# EAGLE design Schematic_Amplifier_2.0.0 (EAGLE 7.5.0)

## Sheet 1 of 2: Power
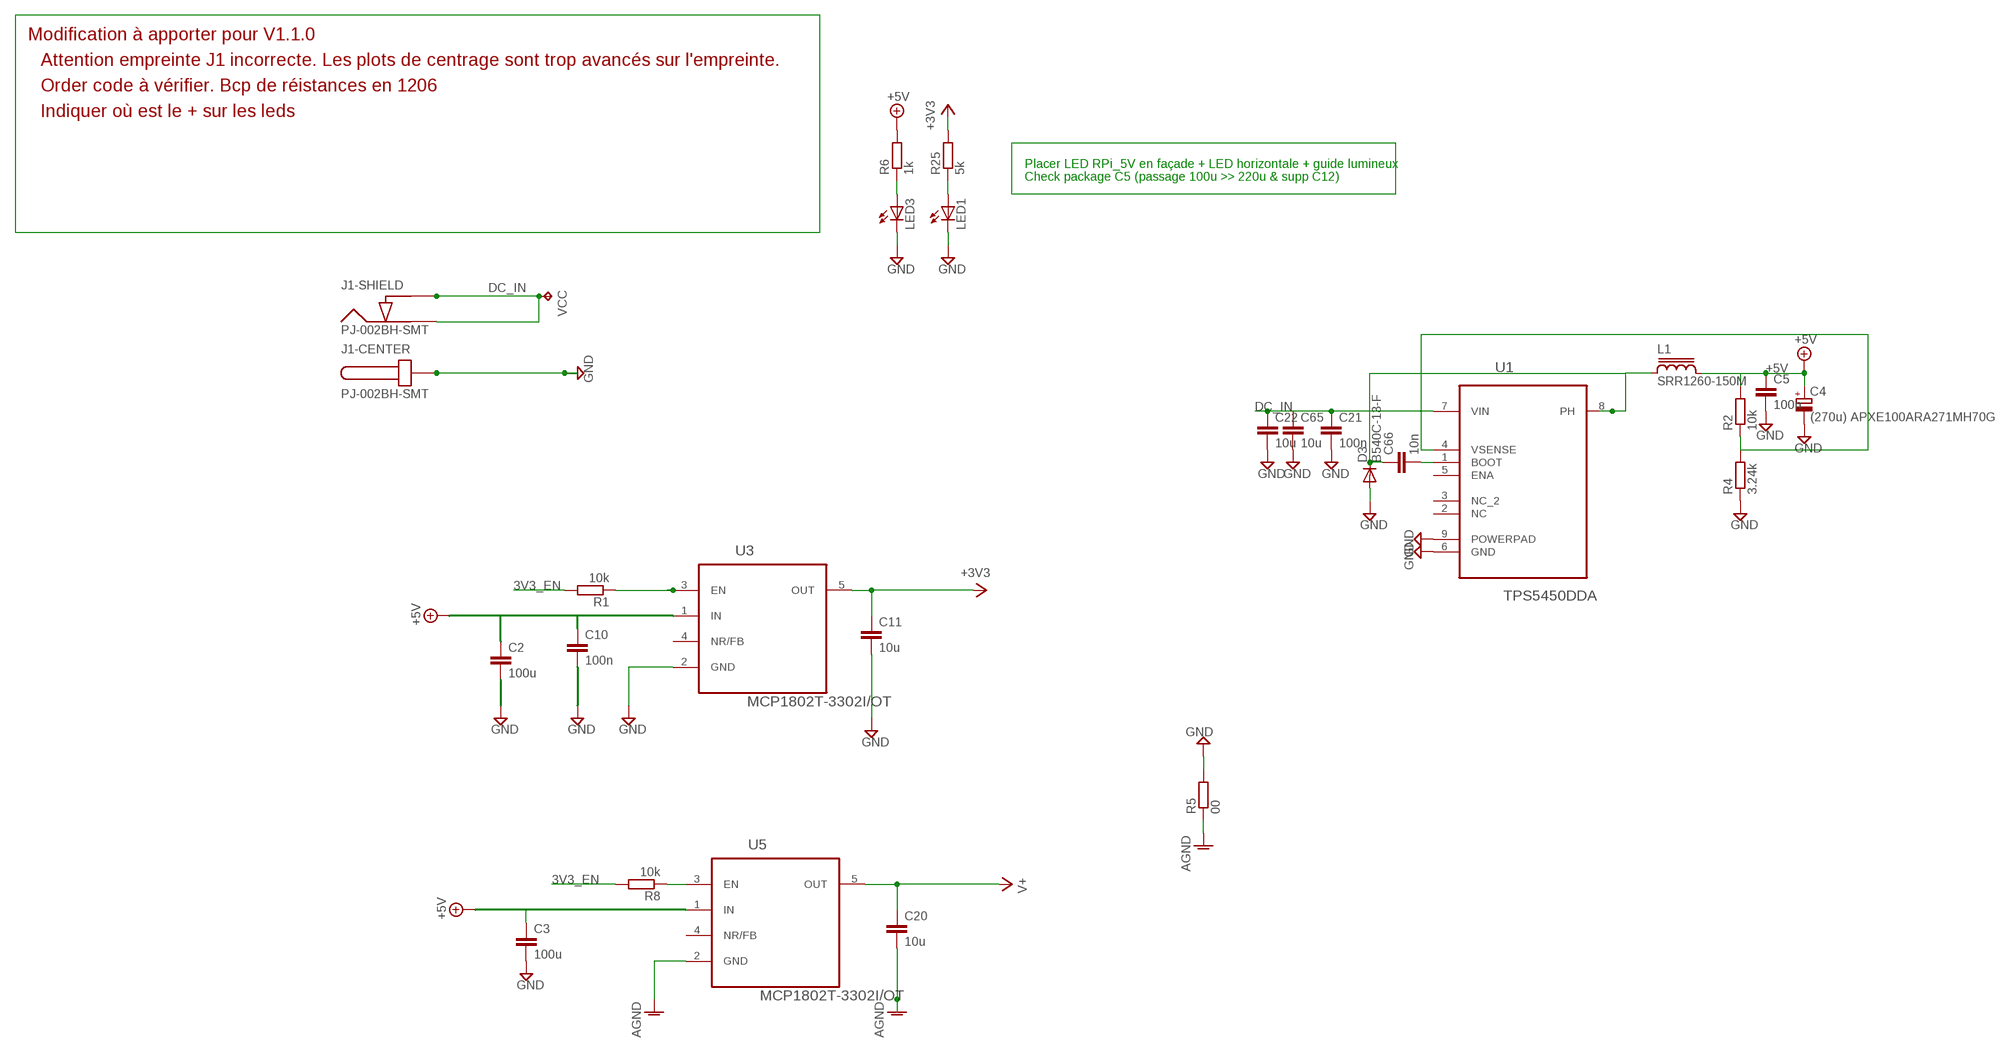
[diagram p0: schematic, sheet 1]

### Parts
C2  100u  C-EUC1206  [C1206]
C3  100u  C-EUC1206  [C1206]
C4  (270u) APXE100ARA271MH70G  CPOL-EU175TMP-0810  [175TMP-0810]
C5  100n  C-EUC0603  [C0603]
C10  100n  C-EUC0603  [C0603]
C11  10u  C-EUC0805  [C0805]
C20  10u  C-EUC0805  [C0805]
C21  100n  C-EUC0603  [C0603]
C22  10u  C-EUC0805  [C0805]
C65  10u  C-EUC0805  [C0805]
C66  10n  C-EUC0603  [C0603]
D3  B540C-13-F  DIODE-SMC  [SMC]
J1  PJ-002BH-SMT  [002BH-SMT]
L1  SRR1260-150M  SRR1280  [SRR1280]
LED1  LEDSML0603  [SML0603]
LED3  LEDSML1206  [SML1206]
R1  10k  R-EU_R0603  [R0603]
R2  10k  R-EU_R0603  [R0603]
R4  3.24k  R-EU_R0603  [R0603]
R5  00  R-EU_R0603  [R0603]
R6  1k  R-EU_R0603  [R0603]
R8  10k  R-EU_R0603  [R0603]
R25  5k  R-EU_R0603  [R0603]
U1  TPS5450DDA  [SOIC127P600X170-9N]
U3  MCP1802T-3302I/OT  TPS73633DBVT  [SOT95P280X145-5N]
U5  MCP1802T-3302I/OT  TPS73633DBVT  [SOT95P280X145-5N]
VCC  TPTP20R  [TP20R]

### Nets
3V3_EN: R1.2 R8.2 ; also sheet 2
+3V3 [+3V3]: C11.1 R25.2 U3.5(OUT) ; also sheet 2
+5V [+3V3]: C2.1 C3.1 C4.+ C5.1 C10.1 L1.2 R2.2 R6.2 U3.1(IN) U5.1(IN) ; also sheet 2
AGND: C20.2 R5.1 U5.2(GND) ; also sheet 2
DC_IN: C21.1 C22.1 C65.1 J1.2 J1.3 U1.7(VIN) VCC.TP ; also sheet 2
GND [GND]: C2.2 C3.2 C4.- C5.2 C10.2 C11.2 C21.2 C22.2 C65.2 D3.A J1.CENTER1 J1.CENTER2 LED1.C LED3.C R4.1 R5.2 U1.6(GND) U1.9(POWERPAD) U3.2(GND) ; also sheet 2
N$6: R1.1 U3.3(EN)
N$9: LED1.A R25.1
N$12: C66.2 U1.1(BOOT)
N$14: LED3.A R6.1
N$54: R8.1 U5.3(EN)
N$56: C66.1 D3.C L1.1 U1.8(PH)
N$57: R2.1 R4.2 U1.4(VSENSE)
V+ [+3V3]: C20.1 U5.5(OUT) ; also sheet 2
Unconnected: U1.2(NC) U1.3(NC_2) U1.5(ENA) U3.4(NR/FB) U5.4(NR/FB)

### Notes on the sheet
- Modification à apporter pour V1.1.0
- Attention empreinte J1 incorrecte. Les plots de centrage sont trop avancés sur l'empreinte.
- Order code à vérifier. Bcp de réistances en 1206
- Indiquer où est le + sur les leds
- Placer LED RPi_5V en façade + LED horizontale + guide lumineux
- Check package C5 (passage 100u >> 220u & supp C12)

## Sheet 2 of 2: Core
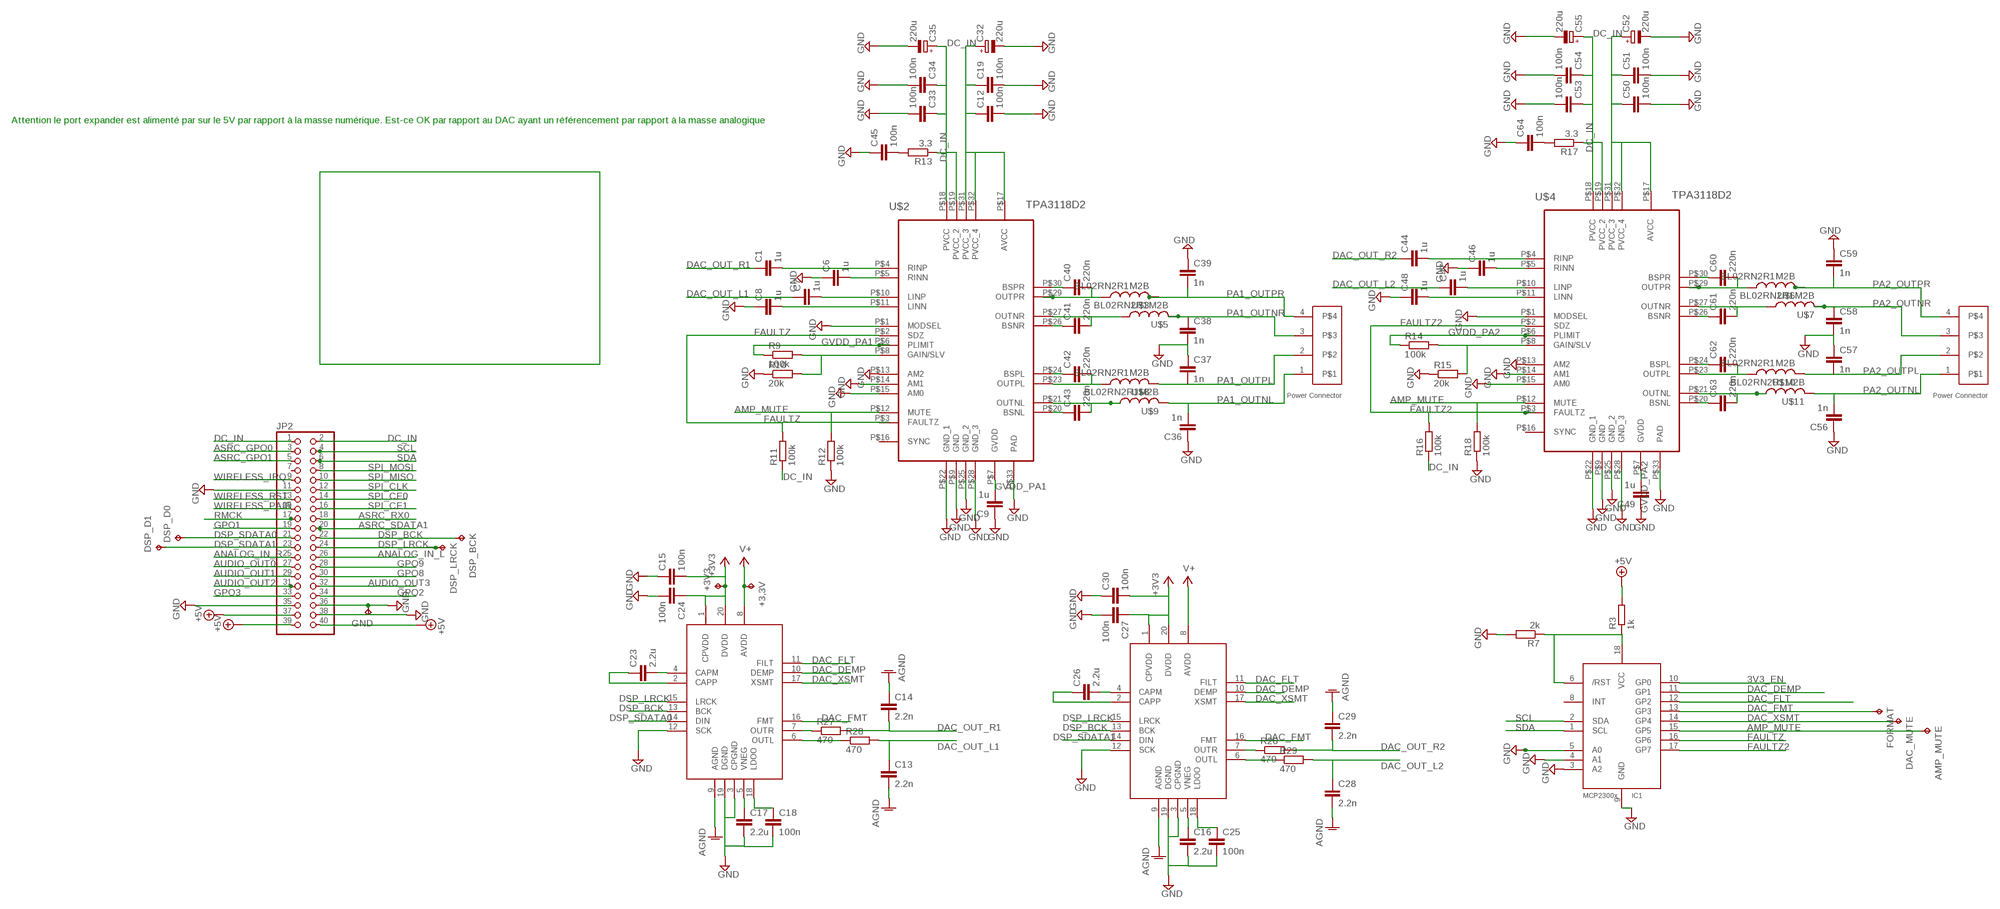
[diagram p1: schematic, sheet 2]

### Parts
+3,3V  TPTP10R  [TP10R]
+3V3  TPTP10R  [TP10R]
AMP_MUTE  TPTP08R  [TP08R]
C1  1u  C-EUC0603  [C0603]
C6  1u  C-EUC0603  [C0603]
C7  1u  C-EUC0603  [C0603]
C8  1u  C-EUC0603  [C0603]
C9  1u  C-EUC0603  [C0603]
C12  100n  C-EUC0603  [C0603]
C13  2.2n  C-EUC0603  [C0603]
C14  2.2n  C-EUC0603  [C0603]
C15  100n  C-EUC0603  [C0603]
C16  2.2u  C-EUC0603  [C0603]
C17  2.2u  C-EUC0603  [C0603]
C18  100n  C-EUC0603  [C0603]
C19  100n  C-EUC0603  [C0603]
C23  2.2u  C-EUC0603  [C0603]
C24  100n  C-EUC0603  [C0603]
C25  100n  C-EUC0603  [C0603]
C26  2.2u  C-EUC0603  [C0603]
C27  100n  C-EUC0603  [C0603]
C28  2.2n  C-EUC0603  [C0603]
C29  2.2n  C-EUC0603  [C0603]
C30  100n  C-EUC0603  [C0603]
C32  220u  CPOL-EUE2.5-6  [E2,5-6]
C33  100n  C-EUC0603  [C0603]
C34  100n  C-EUC0603  [C0603]
C35  220u  CPOL-EUE2.5-6  [E2,5-6]
C36  1n  C-EUC0603  [C0603]
C37  1n  C-EUC0603  [C0603]
C38  1n  C-EUC0603  [C0603]
C39  1n  C-EUC0603  [C0603]
C40  220n  C-EUC0603  [C0603]
C41  220n  C-EUC0603  [C0603]
C42  220n  C-EUC0603  [C0603]
C43  220n  C-EUC0603  [C0603]
C44  1u  C-EUC0603  [C0603]
C45  100n  C-EUC0603  [C0603]
C46  1u  C-EUC0603  [C0603]
C47  1u  C-EUC0603  [C0603]
C48  1u  C-EUC0603  [C0603]
C49  1u  C-EUC0603  [C0603]
C50  100n  C-EUC0603  [C0603]
C51  100n  C-EUC0603  [C0603]
C52  220u  CPOL-EUE2.5-6  [E2,5-6]
C53  100n  C-EUC0603  [C0603]
C54  100n  C-EUC0603  [C0603]
C55  220u  CPOL-EUE2.5-6  [E2,5-6]
C56  1n  C-EUC0603  [C0603]
C57  1n  C-EUC0603  [C0603]
C58  1n  C-EUC0603  [C0603]
C59  1n  C-EUC0603  [C0603]
C60  220n  C-EUC0603  [C0603]
C61  220n  C-EUC0603  [C0603]
C62  220n  C-EUC0603  [C0603]
C63  220n  C-EUC0603  [C0603]
C64  100n  C-EUC0603  [C0603]
DAC0  PCM5102A  [20L-TSSOP]
DAC1  PCM5102A  [20L-TSSOP]
DAC_MUTE  TPTP08R  [TP08R]
DSP_BCK  TPTP08R  [TP08R]
DSP_D0  TPTP08R  [TP08R]
DSP_D1  TPTP08R  [TP08R]
DSP_LRCK  TPTP08R  [TP08R]
FORMAT  TPTP08R  [TP08R]
GND  TPTP19SQ  [TP19SQ]
IC1  MCP23008/SO  [SO18W]
JP2  PINHD-2X20  [2X20]
R3  1k  R-EU_R0603  [R0603]
R7  2k  R-EU_R0603  [R0603]
R9  100k  R-EU_R0603  [R0603]
R10  20k  R-EU_R0603  [R0603]
R11  100k  R-EU_R0603  [R0603]
R12  100k  R-EU_R0603  [R0603]
R13  3.3  R-EU_R0603  [R0603]
R14  100k  R-EU_R0603  [R0603]
R15  20k  R-EU_R0603  [R0603]
R16  100k  R-EU_R0603  [R0603]
R17  3.3  R-EU_R0603  [R0603]
R18  100k  R-EU_R0603  [R0603]
R26  470  R-EU_R0603  [R0603]
R27  470  R-EU_R0603  [R0603]
R28  470  R-EU_R0603  [R0603]
R29  470  R-EU_R0603  [R0603]
U$1  1-1123723-4  [POWER_CON_HEADER]
U$2  TPA3118D2  [TSSOP32]
U$3  BL02RN2R1M2B  FB  [FB]
U$4  TPA3118D2  [TSSOP32]
U$5  BL02RN2R1M2B  FB  [FB]
U$6  BL02RN2R1M2B  FB  [FB]
U$7  BL02RN2R1M2B  FB  [FB]
U$8  BL02RN2R1M2B  FB  [FB]
U$9  BL02RN2R1M2B  FB  [FB]
U$10  BL02RN2R1M2B  FB  [FB]
U$11  BL02RN2R1M2B  FB  [FB]
U$12  1-1123723-4  [POWER_CON_HEADER]

### Nets
3V3_EN: IC1.10(GP0) ; also sheet 1
$OUTR: DAC0.7(OUTR) R26.1
+3V3 [+3V3]: +3V3.TP C15.2 C24.1 C27.1 C30.2 DAC0.1(CPVDD) DAC0.20(DVDD) DAC1.1(CPVDD) DAC1.20(DVDD) ; also sheet 1
+5V [+3V3]: JP2.37 JP2.39 JP2.40 R3.2 ; also sheet 1
AGND: C13.2 C14.1 C28.2 C29.1 DAC0.9(AGND) DAC1.9(AGND) ; also sheet 1
AMP_MUTE: AMP_MUTE.TP IC1.15(GP5) R12.2 R18.2 U$2.P$12(MUTE) U$4.P$12(MUTE)
ANALOG_IN_L: JP2.26
ANALOG_IN_R: JP2.25
ASRC_GPO0: JP2.3
ASRC_GPO1: JP2.5
ASRC_RX0 [Clock]: JP2.18
ASRC_SDATA1 [Clock]: JP2.20
AUDIO_OUT0: JP2.27
AUDIO_OUT1: JP2.29
AUDIO_OUT2: JP2.31
AUDIO_OUT3: JP2.32
DAC_DEMP: DAC0.10(DEMP) DAC1.10(DEMP) IC1.11(GP1)
DAC_FLT: DAC0.11(FILT) DAC1.11(FILT) IC1.12(GP2)
DAC_FMT: DAC0.16(FMT) DAC1.16(FMT) FORMAT.TP IC1.13(GP3)
DAC_OUT_L1: C7.1 C13.1 R28.2
DAC_OUT_L2: C28.1 C47.1 R29.2
DAC_OUT_R1: C1.1 C14.2 R27.2
DAC_OUT_R2: C29.2 C44.1 R26.2
DAC_XSMT: DAC0.17(XSMT) DAC1.17(XSMT) DAC_MUTE.TP IC1.14(GP4)
DC_IN: C12.1 C19.1 C32.+ C33.1 C34.1 C35.+ C50.1 C51.1 C52.+ C53.1 C54.1 C55.+ JP2.1 JP2.2 R11.1 R13.1 R16.1 R17.1 U$2.P$17(AVCC) U$2.P$18(PVCC) U$2.P$31(PVCC_3) U$2.P$32(PVCC_4) U$4.P$17(AVCC) U$4.P$18(PVCC) U$4.P$31(PVCC_3) U$4.P$32(PVCC_4) ; also sheet 1
DSP_BCK [Clock]: DAC0.13(BCK) DAC1.13(BCK) DSP_BCK.TP JP2.22
DSP_LRCK [Clock]: DAC0.15(LRCK) DAC1.15(LRCK) DSP_LRCK.TP JP2.24
DSP_SDATA0 [Clock]: DAC1.14(DIN) DSP_D0.TP JP2.21
DSP_SDATA1 [Clock]: DAC0.14(DIN) DSP_D1.TP JP2.23
FAULTZ: IC1.16(GP6) R11.2 U$2.P$2(SDZ)
FAULTZ2: IC1.17(GP7) R16.2 U$4.P$2(SDZ) U$4.P$3(FAULTZ)
GND [GND]: C6.1 C8.1 C9.1 C12.2 C15.1 C16.2 C17.2 C18.2 C19.2 C24.2 C25.2 C27.2 C30.1 C32.- C33.2 C34.2 C35.- C36.1 C37.1 C38.2 C39.1 C45.1 C46.1 C48.1 C49.1 C50.2 C51.2 C52.- C53.2 C54.2 C55.- C56.1 C57.1 C58.2 C59.1 C64.1 DAC0.3(CPGND) DAC0.12(SCK) DAC0.19(DGND) DAC1.3(CPGND) DAC1.12(SCK) DAC1.19(DGND) GND.TP IC1.3(A2) IC1.4(A1) IC1.5(A0) IC1.9(GND) JP2.11 JP2.35 JP2.36 JP2.38 R7.2 R10.1 R12.1 R15.1 R18.1 U$2.P$1(MODSEL) U$2.P$9(GND) U$2.P$13(AM2) U$2.P$14(AM1) U$2.P$15(AM0) U$2.P$22(GND_1) U$2.P$25(GND_2) U$2.P$28(GND_3) U$2.P$33(PAD) U$4.P$1(MODSEL) U$4.P$9(GND) U$4.P$13(AM2) U$4.P$14(AM1) U$4.P$15(AM0) U$4.P$22(GND_1) U$4.P$25(GND_2) U$4.P$28(GND_3) U$4.P$33(PAD) ; also sheet 1
GPO1: JP2.19
GPO2: JP2.34
GPO3: JP2.33
GPO8: JP2.30
GPO9: JP2.28
GVDD_PA1: C9.2 R9.1 U$2.P$6(PLIMIT) U$2.P$7(GVDD)
GVDD_PA2: C49.2 R14.1 U$4.P$6(PLIMIT) U$4.P$7(GVDD)
N$3: C1.2 U$2.P$4(RINP)
N$4: IC1.6(/RST) IC1.18(VCC) R3.1 R7.1
N$5: C6.2 U$2.P$5(RINN)
N$7: C7.2 U$2.P$10(LINP)
N$8: C8.2 U$2.P$11(LINN)
N$13: U$2.P$19(PVCC_2)
N$16: R9.2 R10.2 U$2.P$8(GAIN/SLV)
N$17: C41.2 U$2.P$27(OUTNR) U$5.P$1
N$18: C40.2 U$2.P$29(OUTPR) U$3.P$1
N$19: C42.2 U$2.P$23(OUTPL) U$8.P$1
N$20: C43.2 U$2.P$21(OUTNL) U$9.P$1
N$21: C44.2 U$4.P$4(RINP)
N$22: C40.1 U$2.P$30(BSPR)
N$23: C17.1 DAC1.5(VNEG)
N$24: C23.2 DAC1.4(CAPM)
N$26: C45.2 R13.2
N$27: C46.2 U$4.P$5(RINN)
N$28: C47.2 U$4.P$10(LINP)
N$29: C41.1 U$2.P$26(BSNR)
N$30: C42.1 U$2.P$24(BSPL)
N$31: C43.1 U$2.P$20(BSNL)
N$32: C48.2 U$4.P$11(LINN)
N$33: DAC1.7(OUTR) R27.1
N$34: DAC1.6(OUTL) R28.1
N$35: C16.1 DAC0.5(VNEG)
N$36: C25.1 DAC0.18(LDOO)
N$37: C26.2 DAC0.4(CAPM)
N$38: C18.1 DAC1.18(LDOO)
N$39: C26.1 DAC0.2(CAPP)
N$40: R14.2 R15.2 U$4.P$8(GAIN/SLV)
N$41: C23.1 DAC1.2(CAPP)
N$42: DAC0.6(OUTL) R29.1
N$44: U$4.P$19(PVCC_2)
N$45: C61.2 U$4.P$27(OUTNR) U$7.P$1
N$46: C60.2 U$4.P$29(OUTPR) U$6.P$1
N$47: C62.2 U$4.P$23(OUTPL) U$10.P$1
N$48: C63.2 U$4.P$21(OUTNL) U$11.P$1
N$49: C60.1 U$4.P$30(BSPR)
N$50: C61.1 U$4.P$26(BSNR)
N$51: C62.1 U$4.P$24(BSPL)
N$52: C63.1 U$4.P$20(BSNL)
N$53: C64.2 R17.2
PA1_OUTNL: C36.2 U$1.1 U$9.P$2
PA1_OUTNR: C38.1 U$1.3 U$5.P$2
PA1_OUTPL: C37.2 U$1.2 U$8.P$2
PA1_OUTPR: C39.2 U$1.4 U$3.P$2
PA2_OUTNL: C56.2 U$11.P$2 U$12.1
PA2_OUTNR: C58.1 U$7.P$2 U$12.3
PA2_OUTPL: C57.2 U$10.P$2 U$12.2
PA2_OUTPR: C59.2 U$6.P$2 U$12.4
RMCK [Clock]: JP2.17
SCL: IC1.2(SDA) JP2.4
SDA: IC1.1(SCL) JP2.6
SPI_CE0 [GND]: JP2.14
SPI_CE1 [GND]: JP2.16
SPI_CLK: JP2.12
SPI_MISO: JP2.10
SPI_MOSI: JP2.8
V+ [+3V3]: +3,3V.TP DAC0.8(AVDD) DAC1.8(AVDD) ; also sheet 1
WIRELESS_IRQ: JP2.9
WIRELESS_PAIR: JP2.15
WIRELESS_RST: JP2.13
Unconnected: IC1.8(INT) JP2.7 U$2.P$16(SYNC) U$4.P$16(SYNC)

### Notes on the sheet
- Attention le port expander est alimenté par sur le 5V par rapport à la masse numérique. Est-ce OK par rapport au DAC ayant un référencement par rapport à la masse analogique

## Power pins joined to a net without a drawn wire
FAULTZ: U$2.P$3(FAULTZ)

## Library data of the parts
+3,3V +3V3 AMP_MUTE DAC_MUTE DSP_BCK DSP_D0 DSP_D1 DSP_LRCK FORMAT GND VCC = testpad:TP: Test pad
C1-C3 C5-C30 C33 C34 C36-C51 C53 C54 C56-C66 = rcl:C-EU: CAPACITOR, European symbol
C4 = resistor:CPOL-EU: POLARIZED CAPACITOR, European symbol
C32 C35 C52 C55 = rcl:CPOL-EU: POLARIZED CAPACITOR, European symbol
D3 = diode:DIODE-: DIODE
DAC0 DAC1 = Texas Instruments_By_element14_Batch_1:PCM5102A: 2VRMS DirectPath™, 112/106/100dB Audio Stereo DAC with 32-bit, 384kHz PCM Interface
IC1 = adafruit:MCP23008: MCP23008 Inexpensive i2c i/o expander - 8 general purpose i/o pins with optional pullups
J1 = volks73-cui :PJ-?: DC Power Jack Documentation Datasheet <http://www.cui.com/product/resource/pj-002bh-smt.pdf> Datasheet <http://www.cui.com/product/resource/pj-014dh-smt.pdf> Features designed for pick and place 5A current rating narrow footprint; CATEGORY: Connectors, Interconnects; COLOR: Black; CONNECTOR_TYPE: Jack; CONTACT_MATERIAL: Copper Alloy; CONTACT_MATERIAL-PLATING: Nickel; CURRENT_RATING: 5A; DESCRIPTION: CONN POWER JACK 2.5X5.5MM HI CUR; DOCUMENTATION_LINK: <a href="http://www.cui.com/product/resource/pj-002bh-smt.pdf">Datasheet</a>; DOCUMENTATION_URL: http://www.cui.com/product/resource/pj-002bh-smt.pdf; FAMILY: Barrel - Power Connectors; FEATURES: -; GENDER: Male; HOUSING_MATERIAL: Thermoplastic; INTERNAL_SWITCHS: Single Switch, Normally Closed; MANUFACTURER: CUI Inc; MOUNTING_TYPE: Surface Mount, Right Angle; NUMBER_OF_POSITIONS-CONTACTS: 2 Conductors, 3 Contacts; OPERATING_TEMPERATURE: -25°C ~ 85°C; PART_NUMBER: PJ-002BH-SMT-TR; PLUG-MATING_PLUG_DIAMETER: 2.5mm ID, 5.5mm OD; SERIES: -; SHIELDING: Unshielded; SUPPLIER_ITEM_LINK: <a href="http://www.digikey.com/product-detail/en/PJ-002BH-SMT-TR/CP-002BHPJCT-ND/669694">Details</a>; SUPPLIER_ITEM_NUMBER: CP-002BHPJCT-ND; SUPPLIER_ITEM_URL: http://www.digikey.com/product-detail/en/PJ-002BH-SMT-TR/CP-002BHPJCT-ND/669694; SUPPLIER_LINK: <a href="http://www.digikey.com">Home Page</a>; SUPPLIER_NAME: Digi-Key; SUPPLIER_URL: http://www.digikey.com; TERMINATION: Solder; VOLTAGE-RATED: 24VDC
JP2 = pinhead:PINHD-2X20: PIN HEADER
L1 = Bourns - inductor:SRR1280: POWER INDUCTOR
LED1 LED3 = led:LED: LED OSRAM: - CHIPLED LG R971, LG N971, LY N971, LG Q971, LY Q971, LO R971, LY R971 LH N974, LH R974 LS Q976, LO Q976, LY Q976 LO Q996 - Hyper CHIPLED LW Q18S LB Q993, LB Q99A, LB R99A - SideLED LS A670, LO A670, LY A670, LG A670, LP A670 LB A673, LV A673, LT A673, LW A673 LH A674 LY A675 LS A676, LA A676, LO A676, LY A676, LW A676 LS A679, LY A679, LG A679 - Hyper Micro SIDELED® LS Y876, LA Y876, LO Y876, LY Y876 LT Y87S - SmartLED LW L88C, LW L88S LB L89C, LB L89S, LG L890 LS L89K, LO L89K, LY L89K LS L896, LA L896, LO L896, LY L896 - TOPLED LS T670, LO T670, LY T670, LG T670, LP T670 LSG T670, LSP T670, LSY T670, LOP T670, LYG T670 LG T671, LOG T671, LSG T671 LB T673, LV T673, LT T673, LW T673 LH T674 LS T676, LA T676, LO T676, LY T676, LB T676, LH T676, LSB T676, LW T676 LB T67C, LV T67C, LT T67C, LS T67K, LO T67K, LY T67K, LW E67C LS E67B, LA E67B, LO E67B, LY E67B, LB E67C, LV E67C, LT E67C LW T67C LS T679, LY T679, LG T679 LS T770, LO T770, LY T770, LG T770, LP T770 LB T773, LV T773, LT T773, LW T773 LH T774 LS E675, LA E675, LY E675, LS T675 LS T776, LA T776, LO T776, LY T776, LB T776 LHGB T686 LT T68C, LB T68C - Hyper Mini TOPLED® LB M676 - Mini TOPLED Santana® LG M470 LS M47K, LO M47K, LY M47K Source: http://www.osram.convergy.de LUXEON: - LUMILED® LXK2-PW12-R00, LXK2-PW12-S00, LXK2-PW14-U00, LXK2-PW14-V00 LXK2-PM12-R00, LXK2-PM12-S00, LXK2-PM14-U00 LXK2-PE12-Q00, LXK2-PE12-R00, LXK2-PE12-S00, LXK2-PE14-T00, LXK2-PE14-U00 LXK2-PB12-K00, LXK2-PB12-L00, LXK2-PB12-M00, LXK2-PB14-N00, LXK2-PB14-P00, LXK2-PB14-Q00 LXK2-PR12-L00, LXK2-PR12-M00, LXK2-PR14-Q00, LXK2-PR14-R00 LXK2-PD12-Q00, LXK2-PD12-R00, LXK2-PD12-S00 LXK2-PH12-R00, LXK2-PH12-S00 LXK2-PL12-P00, LXK2-PL12-Q00, LXK2-PL12-R00 Source: www.luxeon.com KINGBRIGHT: KA-3528ASYC Source: www.kingbright.com
R1-R18 R25-R29 = rcl:R-EU_: RESISTOR, European symbol
U1 = Texas Instruments_By_element14_Batch_1:TPS5450DDA: 5-A, WIDE INPUT RANGE, STEP-DOWN SWIFT CONVERTER; MPN: TPS5450DDA; OC_FARNELL: 1564960; OC_NEWARK: 37M0059; PACKAGE: SOIC-8; SUPPLIER: TEXAS INSTRUMENTS
U3 U5 = Texas Instruments_By_element14_Batch_1:TPS73633DBVT: Cap-Free, NMOS, 400mA Low-Dropout Regulator with Reverse Current Protection; MPN: TPS73633DBVT; OC_FARNELL: 1535775; OC_NEWARK: 87H2981; PACKAGE: SOT-23-5; SUPPLIER: Texas Instruments
U$1 U$12 = con-te-connectivity:1-1123723-4: Connecteurs d'alimentation usage intensif VERTICAL HDR 4P low-profile; MOUSER#: 571-111237234
U$2 U$4 = Texas Instruments_By_element14_Batch_1:TPA3118D2: Class-d stereo amplifier 2 × 30 W Into a 8-Ω BTL Load at 24 V
U$3 U$5-U$11 = adafruit:FB: Ferrite bead Digikey #P9821BK-ND

## Net classes
0 default: width 0.152 mm, clearance 0.152 mm
1 Clock: width 0.152 mm, clearance 0.152 mm
2 +3V3: width 0.152 mm, clearance 0.152 mm
3 GND: width 0.152 mm, clearance 0.152 mm

## Board
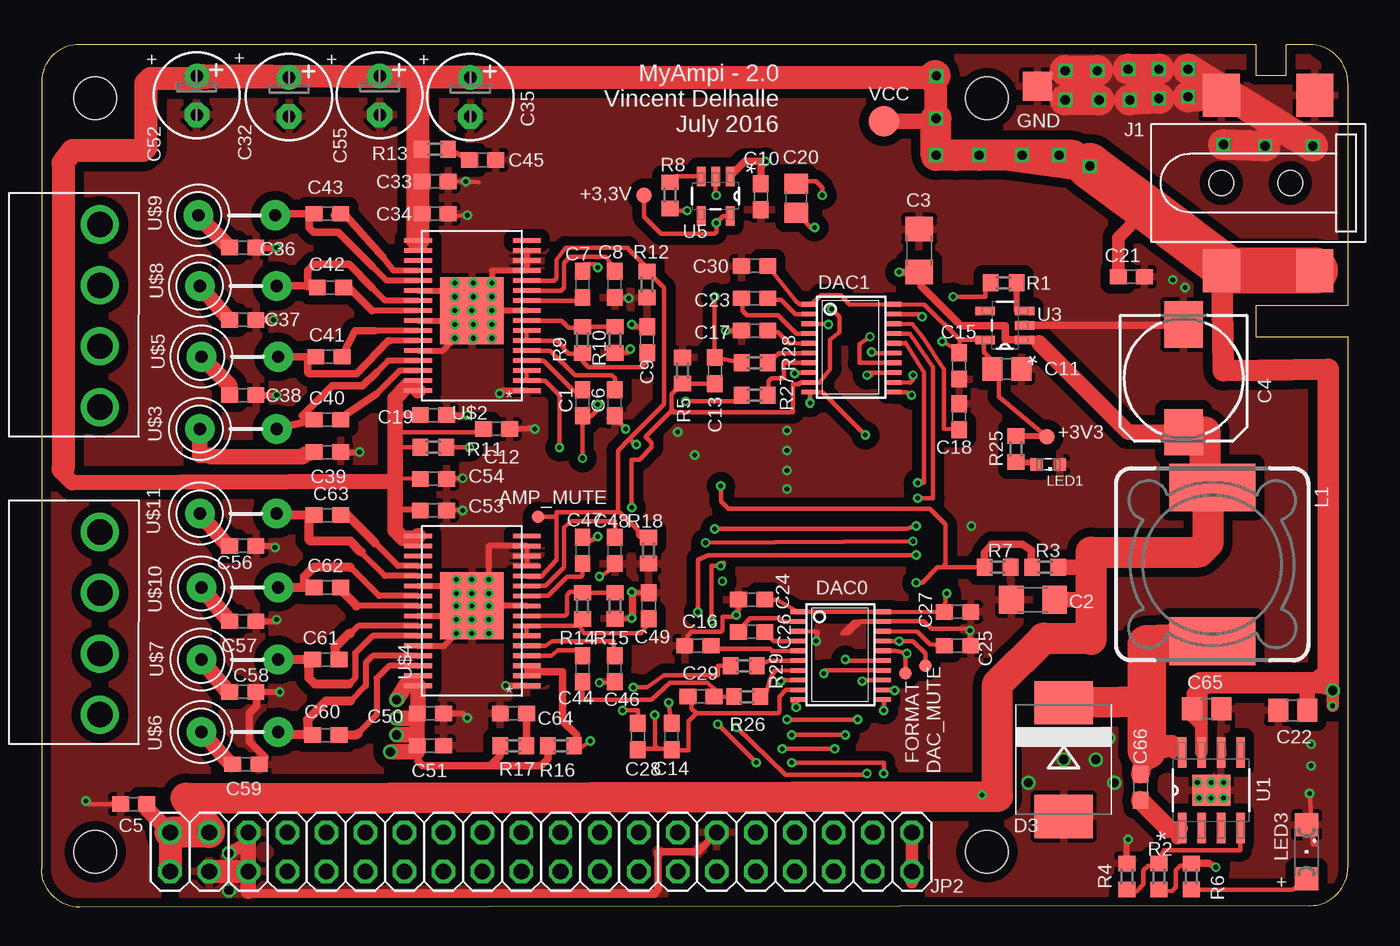
[diagram p2: board, top side]
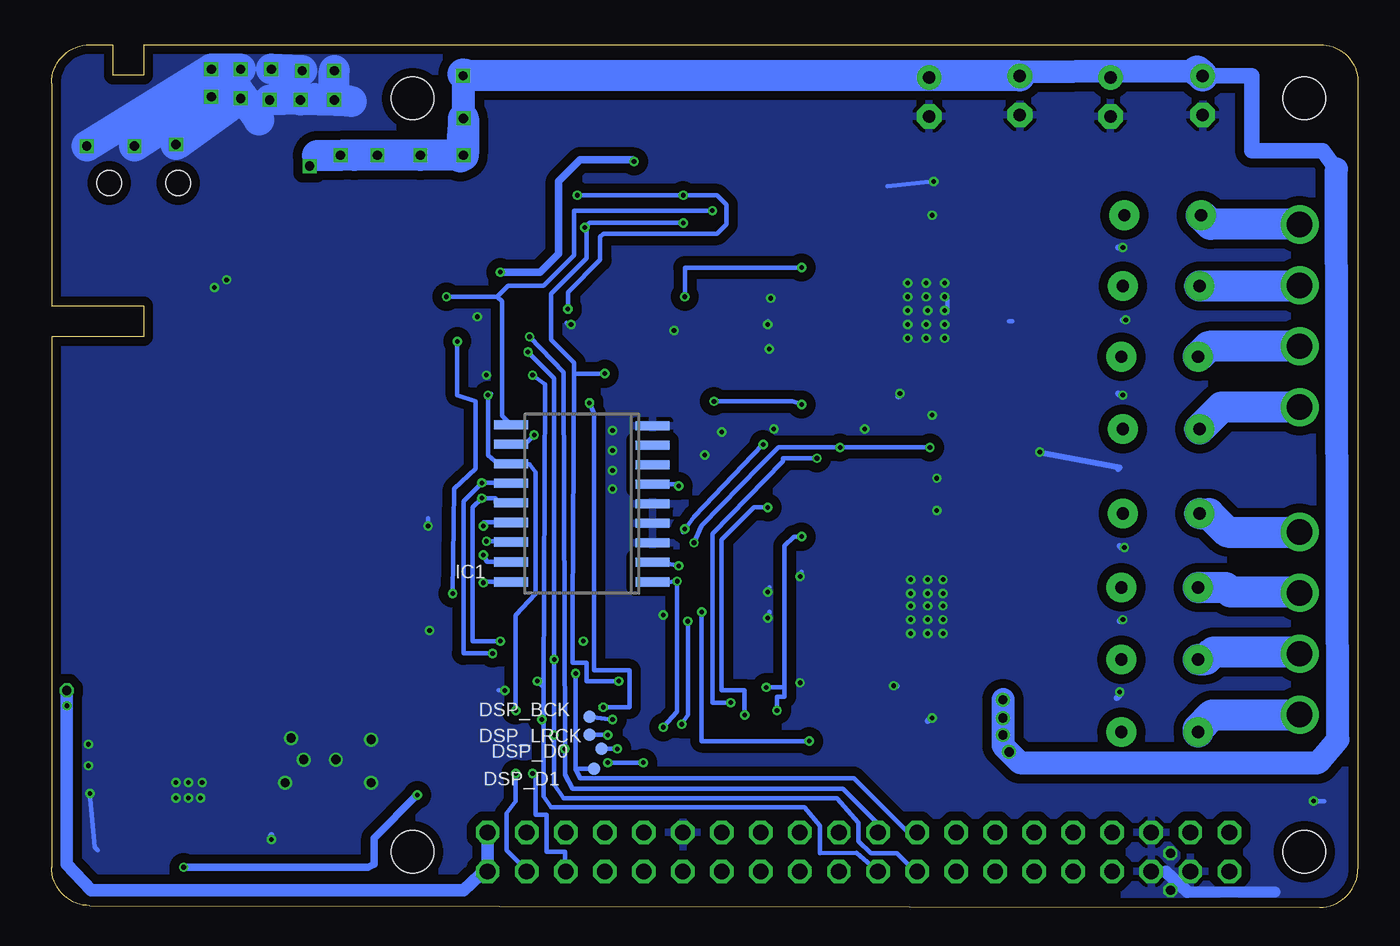
[diagram p3: board, bottom side, seen from below]

Size 85 x 56.1 mm. Coordinates in mm from the lower left corner, seen from the top.
Outline: 0,53.7 0,2.5 arc90 2.5,0 82.5,0.1 arc90 85,2.6 85,37.1 79,37.1 79,39.1 85,39.1 85,53.6 arc90 82.5,56.1 81,56.1 81,54.1 79,54.1 79,56.1 2.5,56.1 arc90 0,53.7
Copper layers (1*16): Top 0.035mm / dielectric 1.6mm / Bottom 0.035mm
Design rules "Elecrow_2-layer_PCB_eagle_rule": minimum track width 6mil, minimum drill 12mil, track to track 6mil, track to pad 8mil, pad to pad 12mil, via to via 12mil, smd to smd 0mil, copper to edge 20mil, drill to drill 10mil, minimum pad ring 6mil, minimum via ring 6mil, stop-mask expansion 0mil, vias tented up to drill 100mil, thermal gap 10mil
Holes 2.75 mm at 3.5,3.6 3.5,52.6 61.5,52.6 61.5,3.6

### Footprints (pad centres in the part's own frame; a part is rotated, then mirrored left to right if it is on the bottom)
TP10R = smd 1 x 1: TP 0,0
TP08R = smd 0.8 x 0.8: TP 0,0
C0603 = smd 1.1 x 1: 1 -0.85,0; 2 0.85,0
C1206 = smd 1.6 x 1.8: 1 -1.4,0; 2 1.4,0
175TMP-0810 = smd 3 x 2.5: + 3.5,0; - -3.5,0
C0805 = smd 1.3 x 1.5: 1 -0.95,0; 2 0.95,0
E2,5-6 = drill 0.813 pad 1.6: + -1.27,0 | drill 0.813 pad 1.6 octagon: - 1.27,0
SMC = smd 2.8 x 3.8: A 3.7,0; C -3.7,0
20L-TSSOP = smd 0.305 x 0.991: 1 -3.112,-2.378; 2 -2.478,-2.378; 3 -1.843,-2.378; 4 -1.208,-2.378; 5 -0.573,-2.378; 6 0.062,-2.378; 7 0.698,-2.378; 8 1.333,-2.378; 9 1.968,-2.378; 10 2.603,-2.378; 11 2.603,3.158; 12 1.968,3.158; 13 1.333,3.158; 14 0.698,3.158; 15 0.062,3.158; 16 -0.573,3.158; 17 -1.208,3.158; 18 -1.843,3.158; 19 -2.478,3.158; 20 -3.112,3.158
TP19SQ = smd 1.9 x 1.9: TP 0,0
SO18W = smd 0.6 x 2.2: 1 -4.445,-4.6; 2 -3.175,-4.6; 3 -1.905,-4.6; 4 -0.635,-4.6; 5 0.635,-4.6; 6 1.905,-4.6; 7 3.175,-4.6; 8 4.445,-4.6; 9 5.715,-4.6; 10 5.775,4.6; 11 4.505,4.6; 12 3.235,4.6; 13 1.965,4.6; 14 0.695,4.6; 15 -0.575,4.6; 16 -1.845,4.6; 17 -3.145,4.6; 18 -4.445,4.6
002BH-SMT = smd 2.4 x 2.8: 2 -3.05,-5.7; 3 3.05,-5.7; CENTER1 -3.05,5.7; CENTER2 3.05,5.7 | hole 1.6: -3.05,0; 1.45,0
2X20 = drill 1.016 octagon: 1 -24.13,-1.27; 2 -24.13,1.27; 3 -21.59,-1.27; 4 -21.59,1.27; 5 -19.05,-1.27; 6 -19.05,1.27; 7 -16.51,-1.27; 8 -16.51,1.27; 9 -13.97,-1.27; 10 -13.97,1.27; 11 -11.43,-1.27; 12 -11.43,1.27; 13 -8.89,-1.27; 14 -8.89,1.27; 15 -6.35,-1.27; 16 -6.35,1.27; 17 -3.81,-1.27; 18 -3.81,1.27; 19 -1.27,-1.27; 20 -1.27,1.27; 21 1.27,-1.27; 22 1.27,1.27; 23 3.81,-1.27; 24 3.81,1.27; 25 6.35,-1.27; 26 6.35,1.27; 27 8.89,-1.27; 28 8.89,1.27; 29 11.43,-1.27; 30 11.43,1.27; 31 13.97,-1.27; 32 13.97,1.27; 33 16.51,-1.27; 34 16.51,1.27; 35 19.05,-1.27; 36 19.05,1.27; 37 21.59,-1.27; 38 21.59,1.27; 39 24.13,-1.27; 40 24.13,1.27
SRR1280 = smd 5.6 x 3.1: 1 0.635,5; 2 0.635,-5
SML0603 = smd 0.8 x 0.8: A 0.75,0; C -0.75,0
SML1206 = smd 1.5 x 1.5: A 1.75,0; C -1.75,0
R0603 = smd 1 x 1.1: 1 -0.85,0; 2 0.85,0
SOIC127P600X170-9N = smd 1.981 x 0.559: 1 -2.464,1.905; 2 -2.464,0.635; 3 -2.464,-0.635; 4 -2.464,-1.905; 5 2.464,-1.905; 6 2.464,-0.635; 7 2.464,0.635; 8 2.464,1.905 | smd 2.007 x 2.489: 9 0,0
SOT95P280X145-5N = smd 1.27 x 0.559: 1 -1.295,0.94; 2 -1.295,0; 3 -1.295,-0.94; 4 1.295,-0.94; 5 1.295,0.94
POWER_CON_HEADER = drill 1.65: 1 0,0; 2 3.96,0; 3 7.92,0; 4 11.88,0
TSSOP32 = smd 1.8 x 0.3: P$1 -3.57,5.2; P$2 -3.57,4.55; P$3 -3.57,3.9; P$4 -3.57,3.25; P$5 -3.57,2.6; P$6 -3.57,1.95; P$7 -3.57,1.3; P$8 -3.57,0.65; P$9 -3.57,0; P$10 -3.57,-0.65; P$11 -3.57,-1.3; P$12 -3.57,-1.95; P$13 -3.57,-2.6; P$14 -3.57,-3.25; P$15 -3.57,-3.9; P$16 -3.57,-4.55; P$17 3.5,-4.55; P$18 3.5,-3.9; P$19 3.5,-3.25; P$20 3.5,-2.6; P$21 3.5,-1.95; P$22 3.5,-1.3; P$23 3.5,-0.65; P$24 3.5,0; P$25 3.5,0.65; P$26 3.5,1.3; P$27 3.5,1.95; P$28 3.5,2.6; P$29 3.5,3.25; P$30 3.5,3.9; P$31 3.5,4.55; P$32 3.5,5.2 | smd 4.11 x 4.36: P$33 0,0
FB = drill 0.8 pad 1.93: P$1 -2.5,0; P$2 2.5,0
TP20R = smd 2 x 2: TP 0,0

### Placement (x,y rotation side)
+3,3V  39.2,46.3 0 top
+3V3  65.4,30.6 0 top
AMP_MUTE  32.3,25.4 0 top
C1  35.2,32.8 90 top
C2  64.5,20 180 top
C3  57.1,42.7 90 top
C4  74.3,34.4 270 top
C5  6,6.7 180 top
C6  37.3,32.8 90 top
C7  35.2,40.5 270 top
C8  37.3,40.5 90 top
C9  39.4,36.9 270 top
C10  46.8,46.2 270 top
C11  62.8,35 0 top
C12  29.6,31.1 0 top
C13  43.8,34.9 270 top
C14  41,11.1 90 top
C15  59.7,35.2 90 top
C16  42.7,17 180 top
C17  46.4,37.5 180 top
C18  59.7,31.9 90 top
C19  25.5,32 0 top
C20  49.1,46.1 90 top
C21  70.9,41 0 top
C22  81.4,12.8 180 top
C23  46.4,39.6 180 top
C24  46.2,20 180 top
C25  59.6,17 0 top
C26  46.2,17.9 0 top
C27  59.6,19.2 0 top
C28  38.8,11.1 270 top
C29  42.9,13.7 0 top
C30  46.4,41.7 0 top
C32  16.1,52.7 270 top
C33  25.6,47.2 0 top
C34  25.6,45.1 0 top
C35  27.9,52.7 270 top
C36  13.1,42.9 180 top
C37  13.1,38.2 180 top
C38  13.1,33.3 0 top
C39  18.6,29.6 180 top
C40  18.6,31.7 180 top
C41  18.7,35.8 180 top
C42  18.8,40.3 180 top
C43  18.6,45.1 180 top
C44  35.2,15.5 90 top
C45  28.7,48.6 180 top
C46  37.3,15.5 90 top
C47  35.2,23.2 270 top
C48  37.3,23.2 90 top
C49  39.5,19.6 270 top
C50  25.3,12.6 0 top
C51  25.3,10.5 0 top
C52  10.1,52.8 270 top
C53  25.5,25.8 0 top
C54  25.5,27.85 0 top
C55  22,52.8 270 top
C56  13.1,23.5 180 top
C57  13.1,18.6 180 top
C58  13.1,14 0 top
C59  13.3,9.3 180 top
C60  18.5,11.2 180 top
C61  18.5,16.1 180 top
C62  18.6,20.8 180 top
C63  18.6,25.5 180 top
C64  30.7,12.6 0 top
C65  75.8,12.9 0 top
C66  71.5,7.8 270 top
D3  66.5,9.6 270 top
DAC0  51.6,16.1 270 top
DAC1  52.3,36.1 270 top
DAC_MUTE  57.5,15.7 0 top
DSP_BCK  50,12.4 0 bottom
DSP_D0  49.2,10.3 180 bottom
DSP_D1  49.7,9 0 bottom
DSP_LRCK  50,11.2 0 bottom
FORMAT  56.2,15.2 0 top
GND  64.8,53.4 0 top
IC1  50.5,25.6 90 bottom
J1  79.8,47.1 0 top
JP2  32.5,3.6 180 top
L1  76.8,22.3 180 top
LED1  65.5,28.8 180 top
LED3  82.3,3.6 270 top
R1  62.6,40.6 180 top
R2  72.7,2 270 top
R3  65.3,22.1 0 top
R4  70.6,2 270 top
R5  41.7,34.9 90 top
R6  74.8,2 90 top
R7  62.2,22.1 0 top
R8  40.9,46.3 270 top
R9  35.2,36.9 90 top
R10  37.3,36.9 90 top
R11  25.5,29.9 0 top
R12  39.4,40.5 90 top
R13  25.6,49.3 0 top
R14  35.2,19.6 90 top
R15  37.3,19.6 90 top
R16  33.8,10.5 0 top
R17  30.7,10.5 0 top
R18  39.5,23.2 90 top
R25  63.4,29.8 90 top
R26  45.9,13.7 180 top
R27  46.4,33.3 180 top
R28  46.4,35.4 180 top
R29  45.7,15.7 180 top
U1  76.1,7.6 90 top
U3  62.68,37.84 180 top
U5  43.86,46.24 270 top
U$1  3.8,44.4 270 top
U$2  28,38.8 180 top
U$3  12.8,31.1 180 top
U$4  28,19.6 180 top
U$5  12.9,35.8 180 top
U$6  12.9,11.4 180 top
U$7  12.9,16.1 180 top
U$8  12.8,40.4 180 top
U$9  12.7,45 180 top
U$10  12.9,20.8 180 top
U$11  12.8,25.6 180 top
U$12  3.8,24.4 270 top
VCC  54.8,51.1 0 top

### Tracks (layer width: path | path; a pad name or v marks a point on that pad's centre or on a via)
3V3_EN  (via drill 0.3)
  Top 0.3: R1.2 61.4,40.6 61.4,39.7 v59.3,39.7 | R8.2 41.05,45.45 41.2,45.3 v42,45.3
  Bottom 0.3: v59.3,39.7 56,39.7 | 56,39.7 55.7,39.4 55.7,31.98 IC1.10 | v42,45.3 51,45.3 51,42.4 53,40.4 55.3,40.4 56,39.7
$OUTR
  Top 0.3: DAC0.7 47.68,15.38 47.4,14.8 47.1,13.75 R26.1
+3V3  (via drill 0.3)
  Top 0.3: 59.75,36.9 U3.5 61.3,36.82 61.3,36.1 61.85,35.55 C11.1 62.1,35 62.3,34.8 62.3,33.2 +3V3.TP | 59.75,36.9 C15.2 59.45,36.3 v58.6,36.8 | C30.2 49.1,39.4 49.3,39.2 DAC1.1 | DAC1.1 | 59.75,36.9 57.46,39.19 DAC1.20 52.61,39.19 52,39.8 50.7,39.8 50.1,39.2 DAC1.1 | C24.1 47.86,19.99 DAC0.1 DAC0.20 C27.1 58.85,20.35 v58.9,20.4
  Top 0.406: R25.2 65.4,30.65 +3V3.TP
  Bottom 0.3: v58.9,20.4 58.8,27.2 57.4,28.5 57.4,32.9 58.6,33.3 v58.6,36.8
+5V  (via drill 0.3)
  Top 0.3: R2.2 73.55,1.05 73.8,1.3 73.8,2.4 74.1,2.7 74.75,2.7 R6.2 | C5.1 6.85,6.39
  Top 0.406: v61.2,7.3 61.8,7.3 61.9,7.2 | 68.1,23.3 68.3,23.1 | 75.7,26.9 75.77,26.9 L1.2
  Top 0.5: 64.9,36.7 64.7,36.9 U3.1 62.7,36.9 | 62.7,36.9 | 62.7,36.9 62.7,37.8 59.8,37.8 57.2,40.4 57.2,41.2 C3.1 v55.8,41.3 | U5.1 45.76,48.5 v47.1,48.5 46.8,48.2 C10.1 | R6.2 75.95,2.85 v76.4,2.6
  Top 1: C4.+ 70.7,30.9 64.9,36.7 | R3.2 67.8,22.1 68.3,22.6 68.3,23.1 | C2.1 68.1,20 68.3,20.2 | 6.85,6.39 JP2.39
  Top 1.5: JP2.39 JP2.40
  Top 2: C4.+ 75.7,30.9 75.7,26.9 75.9,26.7 75.9,23.7 75.3,23.1 68.3,23.1 68.3,20.2 68.3,17.4 68.2,17.5 65.2,17.5 62.2,14.5 62.2,7.2 61.9,7.2 9.4,7.1 10.91,4.99 JP2.37 JP2.39
  Bottom 0.5: v55.8,41.3 53.2,41.3 52,42.5 52,47.2 50.6,48.6 47.2,48.6 v47.1,48.5 | v76.4,2.6 64.4,2.6 64,2.8 64,4.5 v61.2,7.3
AGND  (via drill 0.3)
  Top 0.3: 48.01,13.7 48,13.7 | 48,13.7 48,12.7 47.9,12.6 42.6,12.6 | 42.6,12.6 42.3,12.9 42.3,13.65 C29.1 | 40.1,10.3 38.8,10.3 C28.2 | 40.1,10.3 40.9,10.3 C14.1 41,10.2 42.1,10.2 42.1,12.1 42.6,12.6 | 49.3,34.1 49.3,34.01 | 49.3,34.01 48.9,34.01 48.9,32.2 41.2,32.2 | 41.2,32.2 41,32.4 41,33.35 R5.1 C13.2 | U5.2 43.86,46.34 v43.9,46.3 | v50.8,46.3 50.8,46.8 50.4,47.2 49.25,47.2 C20.2 | 41.2,32.2 40.9,32.2 39.3,30.6 39.7,30.2 39.7,29.9 38.9,29.1 38.4,29.1 v38.4,26 | v39.9,12.5 39.9,10.5 40.1,10.3 | v51.4,38.9 51.9,38.4 51.9,37.4 51.3,36.9 51.3,35 50.61,34.11 DAC1.9 49.42,34.13 49.3,34.01 | DAC0.9 48.43,14.13 48,13.7
  Bottom 0.3: v50.8,46.3 v43.9,46.3 41.7,46.3 41.1,45.7 41.1,44.4 41.7,43.8 49.1,43.8 49.3,43.6 49.3,42.1 51.4,40 v51.4,38.9 | v39.9,12.5 39.9,14.1 41.4,14.1 41.4,23.9 39.3,26 v38.4,26
AMP_MUTE  (via drill 0.3)
  Top 0.3: U$2.P$12 33.35,40.75 33.5,40.9 33.5,42.1 34.1,42.9 38.15,42.9 38.2,42.8 39.4,41.6 R12.2 39.5,41.3 40.5,40.3 40.5,32.7 38.25,30.45 | 33.5,25.5 33.5,22.6 32.5,21.5 31.6,21.5 U$4.P$12 | 33.5,25.5 33.5,25.7 37.6,25.7 | 37.6,25.7 38.8,24.5 38.8,24.2 38.9,24.1 39.3,24.1 R18.2 | 38.25,30.45 37.5,29.7 37.5,25.8 37.6,25.7 | v56.9,24.8 56.3,24.6 v43.8,24.6 | v38.7,30.1 38.6,30.1 38.25,30.45 | AMP_MUTE.TP 33.4,25.4 33.5,25.5
  Bottom 0.3: IC1.15 56.88,25.03 v56.9,24.8 | v43.8,24.6 43.9,24.4 43.2,25.4 v38.7,30.1
DAC_DEMP  (via drill 0.3)
  Top 0.3: v53.6,30.7 50.8,33.5 50.1,33.5 DAC1.10 50,33.4 v50,32.8 | DAC0.10 49.22,13.42 48.9,13.42 v49.1,13
  Bottom 0.3: v53.6,30.7 54.2,30.1 IC1.11 | v49.1,13 47.4,13 47.4,15.4 49.7,15.4 49.7,32.1 v50,32.8
DAC_FLT  (via drill 0.3)
  Top 0.3: v56.6,33.3 56.3,33.5 55.5,33.5 DAC1.11 | v54.8,12.8 54.8,13.4 DAC0.11
  Bottom 0.3: 56.4,33.4 v56.6,33.3 56.6,29.4 55.9,28.8 54.8,28.8 IC1.12 54.7,28.8 53.9,28.8 53.5,28.3 53.5,20.4 54.8,19 v54.8,12.8
DAC_FMT  (via drill 0.3)
  Top 0.3: v57,27.6 57.4,27.6 57.4,34.8 56.2,36.7 56.17,36.67 DAC1.16 | DAC0.16 55.53,16.67 v56.3,16.5 56.2,16.5 FORMAT.TP
  Bottom 0.3: IC1.13 54.8,27.6 v57,27.6 58.2,26.4 58.2,16.5 v56.3,16.5
DAC_OUT_L1  (via drill 0.3)
  Top 0.3: R28.2 C13.1 v43.8,39.7 | v36.2,41.6 36,41.8 35.3,41.8 35.2,41.7 C7.1
  Bottom 0.3: v36.2,41.6 43.8,41.6 v43.8,39.7
DAC_OUT_L2  (via drill 0.3)
  Top 0.3: C28.1 38.8,12.8 v37.8,12.8 | v36.2,24.1 35.5,23.7 35.3,23.7 35.2,23.8 C47.1 | R29.2 44,15.7 44,15.1 40.5,15.1 39.4,14.3 v38.5,14.3
  Bottom 0.3: v37.8,12.8 37.8,13.7 37.3,13.7 37.3,14.3 | 37.3,14.3 37.3,23.5 36.7,24.1 v36.2,24.1 | v38.5,14.3 37.3,14.3
DAC_OUT_R1  (via drill 0.3)
  Top 0.3: v35.2,29.2 35.2,31.4 | 35.2,31.4 C1.1 | C14.2 v40.8,13.3 | R27.2 45.3,33.3 45.3,32.9 v41.9,32.9 | v36.2,32.7 36.2,32.4 35.2,31.4
  Bottom 0.3: v35.2,29.2 37.4,29.2 37.4,29 42,24.3 42,13.3 v40.8,13.3 | v41.9,32.9 36.8,32.9 v36.2,32.7
DAC_OUT_R2
  Top 0.3: R26.2 C29.2 43.75,14.25 43.3,14.6 40.9,14.6 39.7,13.5 35.2,13.5 C44.1
DAC_XSMT  (via drill 0.3)
  Top 0.3: v57,26.6 58,26.6 58,35.1 56.5,37.3 55.5,37.3 DAC1.17 | DAC0.17 54.8,17.3 v55.8,17.3 56.7,17.3 57.5,16.5 DAC_MUTE.TP
  Bottom 0.3: IC1.14 54.8,26.3 56.1,26.3 56.1,26.6 v57,26.6 57.6,26 57.6,17.3 v55.8,17.3 56.2,17.3
DC_IN  (via drill 0.3, 0.6)
  Top 0.3: U$4.P$32 U$4.P$31 23.85,14.65 | U$4.P$18 U$4.P$17 | 24.5,25.85 C53.1 | U$2.P$31 U$2.P$32 | U$2.P$18 U$2.P$17 | C12.1 28.6,30.9 23,30.9 | R11.1 23.1,29.9 23,29.8 | C54.1 23.1,27.9 23,27.7 | v63.8,48.9 65.3,48.7 65.4,48.8 66.5,48.8 66.8,48.5 69.3,48.5 72.6,45.2 73,45.2 76.81,41.39 | 71.5,45 71.5,45.2 71.8,45.51
  Top 0.4: 24.5,25.85 23.05,25.85 23,25.8 | C19.1 23.1,32 22.9,31.8 23,31.8
  Top 0.5: R17.1 29.85,9.85 29.2,9.2 | 29.2,9.2 24.8,9.2 24.5,9.5 24.5,10.45 C51.1 | R16.1 32.95,9.65 32.5,9.2 29.2,9.2 | C33.1 C34.1 | JP2.1 JP2.2 | C65.1 75.47,12.8
  Top 0.8: JP2.1 56.63,1.63 | 75.47,11.8 75.47,12.8 75.47,14.04 75.4,14.1 | U1.7 75.47,11.8 | 75.47,14.37 75.36,14.37 74.9,13.9 74.9,12.37 75.47,11.8 | v84,13.1 84,15.2 83.7,15.2 | v84,14.1 82.22,14.57 82.1,14.6 | C21.1 70.05,43.55 71.5,45
  Top 1: 23,27.7 23,25.8 23,24.5 23.5,24 24.35,24 U$4.P$17 | 23,27.7 23,29.8 23,30.9 23,31.8 23,33.1 23.8,33.9 24.2,33.9 U$2.P$32 | 1.3,28.3 1.2,28.4 1.4,28.5 1.3,28.3 | 1.3,28.3 2,27.6 23,27.7 | U$4.P$32 24.5,12.65 C50.1 24.45,12.3 | 24.45,12.3 24.45,11.2 | 24.45,11.2 C51.1 24.45,10.1 v22.7,10.1 | 23.85,14.65 v23.1,13.5 | v23.1,12.3 24.45,12.3 | v23.1,11.2 24.45,11.2 | R13.1 C33.1 | VCC.TP 58.08,51.1 58.17,51.01 | C22.1 82.35,14.44 82.22,14.57
  Top 1.1: 24.5,45.1 C34.1 24.5,44.95
  Top 1.4: 75.47,14.37 75.4,14.6 82.1,14.6 83,14.6 83.7,15.2 83.7,35 76.9,34.9 76.81,41.39 76.8,41.8
  Top 1.5: v58.23,54.07 58.14,54.1 58.17,51.01 v58.2,48.9 | 1.4,28.5 1.4,48.4 2,49.2 6.6,49.2 6.8,49.4 6.8,53.6 7.1,53.9 10.2,53.9 10.3,54 16.07,54 C32.+ 10.7,53.97 10.6,54.07 | U$2.P$17 24.5,44.95 | 58,53.97 C35.+ 24,53.99 | 24,53.99 10.6,54.07 | 10.6,54.07 10.2,54.07 C52.+ | 24.5,45.1 24.5,53.99 24,53.99
  Top 2: 67.1,48.9 v66.2,48.9 v63.8,48.9 | v68.2,48.2 63,48.9 v63.8,48.9 | 77.3,41.4 J1.2 | v63.8,48.9 v61,48.9 | v61,48.9 v58.2,48.9 v58.2,51.3 | v61,48.9 59.5,48.9 | 58,53.97 58.14,54.1
  Top 3: J1.3 77.3,41.4 71.8,45.51 v68.2,48.2
  Bottom 0.3: 65.3,48.9 65.1,48.9 65.3,48.7 v63.8,48.9
  Bottom 0.406: v61,48.9 65.3,48.9
  Bottom 0.8: JP2.1 56.63,2.57 58.2,1.1 82.4,1.1 84,2.8 v84,14.1
  Bottom 1: 1.4,48 2.3,49.2 6.9,49.2 6.9,54.07 C52.+
  Bottom 1.5: v58.23,54.07 v58.2,48.9 | v23.1,13.5 23.1,10.5 22,9.4 2.6,9.4 1.3,10.9 1.4,48 | 58.24,54.19 10.48,54.39
  Bottom 2: v58.2,48.9 58.2,49 | 58.2,49 v58.2,51.3 58.4,48.8 58.3,48.9 | 58.2,49 58.3,48.9 | v66.2,48.9 v61,48.9 58.3,48.9 | 67.7,48.9 v66.2,48.9 | 65.3,48.9 v66.2,48.9 | C55.+ 57.76,54.07 58.24,54.19 | 10.48,54.39 C52.+
DSP_BCK  (via drill 0.3)
  Top 0.3: 53.81,34.7 54,34.7 54,34.6 v53.7,34.6 53.87,34.77 DAC1.13 | v48.5,12.2 v53.1,12.2 53.2,12.2 | DAC0.13 53.47,14.77 v53.4,14.7
  Bottom 0.3: JP2.22 32.63,3.53 35,3.5 35,5.3 36,6.5 52.5,6.5 53,7.2 53,12.6 | 53,14.3 52.9,34 v53.7,34.6 | 53,12.6 53,14.3 | 53,14.3 v53.4,14.7 | 49.8,12.2 DSP_BCK.TP v48.5,12.2 | 53,12.6 v53.1,12.2 53.2,12.2
DSP_LRCK  (via drill 0.3)
  Top 0.3: v48.8,11.2 v52.3,11.2 | DAC0.15 52.32,16.02 v52.3,16.1 | DAC1.15 53.94,36.04 v54,36.1
  Bottom 0.3: JP2.24 28.83,2.33 30,3.5 31.7,3.5 32.5,4.3 32.5,5.5 33.9,7.1 51.7,7.1 52.3,8 v52.3,11.2 v52.3,16.1 52.3,34.4 v54,36.1 | DSP_LRCK.TP v48.8,11.2
DSP_SDATA0  (via drill 0.3)
  Top 0.3: v53.9,37.1 53.2,36.6 53.2,35.4 53.9,35.4 DAC1.14 | v48.2,10.3 v51.6,10.3
  Bottom 0.3: JP2.21 31.23,5.43 33.5,7.7 51.1,7.7 51.6,8.6 v51.6,10.3 51.7,34.8 v53.9,37.1 | DSP_D0.TP v48.2,10.3
DSP_SDATA1  (via drill 0.3)
  Top 0.3: v50.9,15.2 51,15.1 51,15.4 54.74,15.4 DAC0.14
  Bottom 0.3: JP2.23 29.27,4.87 32.8,8.4 50.6,8.4 50.9,9 | 50.9,9 v50.9,15.2 | DSP_D1.TP 50.9,9
FAULTZ  (via drill 0.3)
  Top 0.3: U$2.P$3 U$2.P$2 32.75,34.25 33.7,33.3 v33.7,29.9 | v27.85,29.9 R11.2 | v56.7,23.8 v43.2,23.7
  Bottom 0.3: v27.85,29.9 v33.7,29.9 37.7,29.9 38.9,28.7 42.7,24.8 v43.2,23.7 | v56.7,23.8 55.1,23.8 IC1.16
FAULTZ2  (via drill 0.3)
  Top 0.3: U$4.P$3 U$4.P$2 31.75,15.3 | v56.9,22.9 43.4,22.9 42.7,22.6 v42.7,19.2 | v35.7,10.8 34.9,10.25 R16.2
  Top 0.5: 31.75,15.3 33.9,15.3 33.9,12.1 34.8,11.2 34.8,10.65 R16.2
  Bottom 0.3: IC1.17 56.66,22.46 v56.9,22.9 | v42.7,19.2 42.7,10.8 v35.7,10.8
GND  (via drill 0.3, 0.6)
  Top 0.3: U$2.P$33 v26.9,38.8 | v26.9,39.7 26.8,39.8 | C33.2 28.45,47.15 v27.6,47.2 | C34.2 26.65,44.95 v27.7,45 | U$4.P$15 U$4.P$14 | U$4.P$14 31.57,22.83 | 31.57,22.83 31.57,22.33 | 31.57,22.33 31.6,22.3 31.6,22.82 U$4.P$14 | U$4.P$13 31.57,22.33 | 31.57,22.83 31.5,22.9 | C54.2 v27.4,27.9 | C53.2 27.35,25.85 v27.4,25.8 | R15.1 38.45,18.75 v38.4,18.8 | C48.1 37.35,22.15 v36.3,21.5 | C46.1 v36.3,14.6 | C8.1 38.15,39.65 v38.2,39.6 | C6.1 37.3,31.8 v38,31.1 | LED3.C 82.95,4.05 82.7,4.3 82.7,4.1 v82.5,7.4 | DAC0.3 50.48,17.92 v50.4,17.3 | DAC0.12 55.49,14.11 v55.5,14.1 | DAC1.3 51.18,37.92 v51.2,37.9 | C49.1 38.45,20.45 v38.4,20.5 | C17.2 v44.5,37.5 | R10.1 38.05,36.05 v38.3,36.3 | C9.1 38.55,37.75 v38.4,37.9 | C25.2 60.4,17.15 v60.4,18 60.3,18.1 57.9,18.1 57.4,18.6 53.3,18.6 52.5,17.8 52.1,17.8 52.86,18.56 DAC0.19 | 60.45,24.75 v60.5,24.8 | C24.2 45.35,19.15 v45.2,19 45.1,18.9 44.3,18.9 44.3,18 44.2,17.9 42.3,17.9 42.05,17.65 C16.2 | DAC1.19 57.14,38.56 v57.3,38.4 | DAC1.12 56.51,34.11 56.7,34.3 v56.7,34.6 | C5.2 3.1,6.7 v2.9,6.9
  Top 0.4: U$2.P$25 26.15,38.15 26.2,38.1 26.7,38.1 v26.9,37.9 | C36.1 v15.3,42.9 | C37.1 v15.1,38.2 | C38.2 v15.3,33.3 | C39.1 v20.7,29.6 | C56.1 15.1,23.5 v15.2,23.4 | C57.1 15.2,18.6 v15.3,18.7 | C58.2 v15.5,14 | U$4.P$9 v29.1,19.6 | U$4.P$28 26.2,17 v27,17.8 | U$4.P$25 26.75,18.95 v27,18.7 | U$4.P$22 26.5,20.9 v27,20.4 | U$4.P$15 29.1,23.5 v29.1,21.3 | U$2.P$28 26.1,36.2 v26.9,37 | U$2.P$22 26.5,40.1 v26.9,39.7 | v29.3,40.6 29.3,41.4 U$2.P$13 U$2.P$14 U$2.P$15 | U$2.P$9 v29.3,38.8 | C19.2 v27.7,32 | C12.2 31.75,31.15 v32.1,31.1 | U$2.P$1 30,33.6 v29.8,33.4 | U$4.P$1 v30.2,14.4 | C50.2 27.4,12.6 v27.7,12.3
  Top 0.406: R4.1 70.6,4.3 v70.7,4.4
  Top 0.5: 13.45,1.05 13.5,0.9 | U3.2 74.24,37.84 C4.- | C59.1 14.55,9.75 13.5,10.8 13.5,12.6 14,13.1 14,13.95 C58.2 | JP2.11 43.93,4.83 42.7,3.6 40.1,3.6 40.1,1.14 39.86,0.9 | 38.45,20.45 38.45,18.85 v38.4,18.8
  Top 0.6: 13.5,0.9 39.86,0.9
  Top 0.8: JP2.35 13.45,4.25 v12.2,3.5
  Top 1: JP2.35 JP2.36 13.45,1.05
  Top 1.5: JP2.38 JP2.36
  Top 2: J1.CENTER1 v74.6,52.7 | v79.6,49.5 v76.9,49.6 | v72.7,52.6 v70.8,52.5 | v68.8,52.5 v66.6,52.5 | v66.6,54.4 v68.7,54.4 | v70.7,54.5 v72.7,54.5 | v74.6,54.5 v82.7,49.5
  Bottom 0.3: 22.7,38.1 22.5,38.1 | v26.9,38.8 26.7,38.7 26.7,39.5 v26.9,39.7 | v27.6,47.2 30.6,46.9 | v27.4,27.9 27.4,27.8 | v38.4,18.8 38.3,19.2 | v36.3,21.5 36.2,21.8 | v38.2,39.6 38.3,39.6 | v38,31.1 38.1,31 | v82.5,7.4 82.2,3.9 82,3.7 | v50.4,17.3 50.4,17.2 | v55.5,14.1 55.9,14.1 | v51.2,37.9 51.4,37.9 51.5,38 | v38.4,20.5 38.3,20.8 | v38.3,36.3 38.3,36.5 | v38.4,37.9 38.4,38.1 | v60.4,18 60.5,18 | v60.5,24.8 60.5,25.3 | v45.2,19 45.2,18.9 | v57.3,38.4 57.4,38.3 | v56.7,34.6 56.7,34.5 | v2.9,6.9 2.2,6.9
  Bottom 0.4: v15.3,42.9 15.6,42.9 | v15.1,38.2 15.3,38.2 | v15.3,33.3 15.5,33.3 15.6,33.4 | v20.7,29.6 15.5,28.6 15.6,28.5 | v15.2,23.4 15.4,23.4 15.5,23.5 | v15.3,18.7 15.4,18.7 15.5,18.6 | v15.5,14 15.5,13.8 15.7,13.6 | v29.8,33.4 29.8,33.3 29.9,33.2 | v30.2,14.4 30,14.4 | v27.7,12.3 27.8,12.3 28,12.1
  Bottom 0.406: v70.7,4.4 70.7,4.7
  Bottom 0.7: 11.1,1 5.4,1
  Bottom 0.8: 12.5,2.3 11.1,1
  Bottom 2: v74.6,52.7 v79.6,49.5 | v76.9,49.6 v72.7,52.6 | v70.8,52.5 67.9,52.6 65.5,52.4 v68.8,52.5 | v66.6,52.5 v66.6,54.4 | v68.7,54.4 v70.7,54.5 | v72.7,54.5 v74.6,54.5 | v82.7,49.5 v74.6,54.5 | v74.6,54.5 73.9,54.5 71.5,51.2
  other vias: 28.1,37.9 29.3,37.9 29.3,39.7 28.1,39.7 28,38.8 26.9,40.6 28.1,40.6 28.1,37 29.3,37 27,21.3 28,21.3 28,20.4 29.1,20.4 28,18.7 29.1,18.7 27,19.6 28,19.6 28,17.8 29.1,17.8 75.2,8.1 76.9,8.1 76.9,7.1 75.3,7.1 76.1,8.1 76.1,7.1 82.6,9.2 82.6,10.6 12.2,1.1 64.2,8.1 64.2,10.9 66.5,9.6 69.4,11 68.6,9.6 69.8,8.1 74.4,40.3 73.6,40.8 48.5,31 48.5,29.7 48.5,28.4 48.5,27.2 42.5,29.4 41.4,30.9
  pour Top (isolate 0.6): 84.5,52.2 arc90 78.9,55.9 2.7,55.6 arc90 -0.9,50.9 -0.7,3 arc90 3.1,0.6 81.7,0.3 arc90 84.8,4.9
  pour Bottom (isolate 0.6): 84.7,55.8 0.6,55.8 arc90 -0.6,54.6 0.1,2.8 arc90 3.4,0.3 84.3,0
GVDD_PA1
  Top 0.3: U$2.P$7 U$2.P$6 33.55,36.85 34,36.4 34,36.3 34.3,36 35.15,36 R9.1 35.2,35.5 35.6,35.1 39,35.1 39.4,35.5 C9.2
GVDD_PA2
  Top 0.3: U$4.P$6 U$4.P$7 35,18.3 | 35,18.3 35.3,17.8 39,17.8 39.4,18.3 C49.2 | R14.1 35.2,18.5 35,18.3
N$3
  Top 0.3: U$2.P$4 32.65,35.55 34.6,33.6 35.15,33.6 C1.2
N$4  (via drill 0.3)
  Top 0.3: v56.9,21.1 57.3,21.1 58.3,22.1 58.6,22.1 | 58.6,22.1 R7.1 | v44.2,27.4 44.2,26.4 44.7,25.9 57.8,25.9 58.8,24.9 58.8,22.3 58.6,22.1
  Top 0.5: R7.1 61.35,23.05 61.8,23.6 63.8,23.6 64.4,23.2 64.4,22.15 R3.1
  Bottom 0.3: IC1.18 56.84,21.16 v56.9,21.1 | IC1.6 44.3,27.51 v44.2,27.4
N$5
  Top 0.3: C6.2 37.3,34.4 37.1,34.6 34.7,34.6 33.1,36.2 U$2.P$5
N$6
  Top 0.406: U3.3 63.45,38.78 R1.1
N$7
  Top 0.3: U$2.P$10 35,39.45 C7.2
N$8
  Top 0.3: C8.2 37.3,41.5 36.7,42.3 34.4,42.3 34,41.9 34,40.3 33.8,40.1 U$2.P$11
N$9
  Top 0.406: R25.1 64.75,28.95 LED1.A
N$12
  Top 0.3: 73.64,5.14 73.6,5.1 73.35,5.1
  Top 0.8: U1.1 73.9,4.5 73.9,5.14 73.64,5.14
  Top 1.2: 73.35,5.1 C66.2
N$14
  Top 0.3: R6.1 81.4,1.15 LED3.A
N$16
  Top 0.3: R10.2 R9.2 35.15,37.7 34.3,37.7 33.85,38.15 U$2.P$8
N$17
  Top 0.406: U$2.P$27 22.65,36.85
  Top 0.5: 22.65,36.85 22.55,36.85 20.5,34.7 17.4,34.7 17.3,34.8 17.3,35.65 C41.2 U$5.P$1
N$18
  Top 0.406: U$2.P$29 22.55,35.55 21.8,34.8
  Top 0.5: 21.8,34.8 20.9,33.9 18.9,33.9 16.95,31.95 C40.2 U$3.P$1
N$19
  Top 0.406: U$2.P$23 22.35,39.45 21.5,40.3
  Top 0.5: 21.5,40.3 20,41.8 17.7,41.8 17.3,41.4 17.3,40.35 C42.2 17.15,40.4 U$8.P$1
N$20
  Top 0.406: U$2.P$21 22.45,40.75 21.5,41.7
  Top 0.5: 21.5,41.7 19.3,43.9 17.7,43.9 17.4,44.2 17.4,44.95 C43.2 15.1,45.1 U$9.P$1
N$21
  Top 0.3: U$4.P$4 33.15,16.35 33.6,16.7 35.05,16.7 C44.2
N$22
  Top 0.406: U$2.P$30 23.3,34.9 21.8,33.4
  Top 0.5: 21.8,33.4 19.6,31.9 C40.1
N$23
  Top 0.3: DAC1.5 48.65,36.65 47.9,37.4 47.35,37.4 C17.1
N$24
  Top 0.3: DAC1.4 49.11,37.29 47.9,38.5 45.9,38.5 45.6,38.8 45.6,39.55 C23.2
N$26
  Top 0.4: C45.2 R13.2
N$27
  Top 0.3: U$4.P$5 32.8,17 33.2,17.3 37.2,17.3 37.2,16.85 C46.2
N$28
  Top 0.3: U$4.P$10 32.95,20.25 34.2,21.5 35.1,21.5 35.2,21.6 C47.2
N$29
  Top 0.406: U$2.P$26 21.7,37.5 21.6,37.5
  Top 0.5: C41.1 19.65,36.05 20.4,37.5 21.7,37.5
N$30
  Top 0.406: U$2.P$24 21.5,38.8
  Top 0.5: C42.1 20,40.3 21.5,38.8
N$31
  Top 0.406: U$2.P$20 22.9,41.4 22.2,42.3
  Top 0.5: 22.2,42.3 19.8,45 19.05,45 C43.1
N$32
  Top 0.3: U$4.P$11 32.8,20.9 34,22.1 34,24.7 34.5,25.1 37.3,25.1 C48.2
N$33
  Top 0.3: R27.1 47.3,33.35 47.3,34.2 47.5,34.4 48.3,34.4 48.28,35.38 48.3,35.4 DAC1.7
N$34
  Top 0.3: DAC1.6 47.97,36.02 R28.1
N$35
  Top 0.3: DAC0.5 47.55,16.65 47.4,16.8 43.95,16.8 C16.1
N$36
  Top 0.3: DAC0.18 56.98,17.92 57.8,17.1 C25.1
N$37
  Top 0.3: DAC0.4 47.66,17.29 C26.2
N$38
  Top 0.3: DAC1.18 56.68,37.92 57.3,37.1 58.7,35 58.7,31.1 C18.1
N$39
  Top 0.3: DAC0.2 48.34,18.56 47.9,18.8 46.1,18.8 45.2,17.85 C26.1
N$40
  Top 0.3: R15.2 R14.2 35.15,20.5 34.4,20.5 34.2,20.3 34.2,19.1 34.05,18.95 U$4.P$8
N$41
  Top 0.3: DAC1.2 49.04,38.56 48.1,39.5 47.35,39.5 C23.1
N$42
  Top 0.3: DAC0.6 47.37,16.02 R29.1
N$45
  Top 0.4: U$4.P$27 21.55,17.65 20.4,16.5 20.4,14.9 20,14.5
  Top 0.6: 20,14.5 17.8,14.5 17.4,14.9 17.4,16.05 C61.2 U$7.P$1
N$46
  Top 0.4: U$4.P$29 21.55,16.35 21.1,15.9 21.1,14.4 20.1,13.4
  Top 0.6: 20.1,13.4 18.5,13.4 17.3,12.2 17.3,11.25 C60.2 15.2,11.2 U$6.P$1
N$47
  Top 0.4: U$4.P$23 21.95,20.25 20.1,22.1
  Top 0.6: 20.1,22.1 17.7,22.1 17.1,21.5 17.1,20.85 C62.2 U$10.P$1
N$48
  Top 0.4: U$4.P$21 22.35,21.55 20.8,23.1
  Top 0.6: 20.8,23.1 20.1,23.8 17.5,23.8 17.4,23.9 17.4,25.25 C63.2 15.1,25.5 U$11.P$1
N$49
  Top 0.4: U$4.P$30 22.6,15.7 21.8,14.9 21.8,12.5 20.6,11.3
  Top 0.6: C60.1 20.5,11.2 20.6,11.3
N$50
  Top 0.4: U$4.P$26 20.6,18.3 20.1,17.8
  Top 0.6: 20.1,17.8 20,17.8 19.1,16.9 19.1,16.15 C61.1
N$51
  Top 0.4: U$4.P$24 20.5,19.6
  Top 0.6: C62.1 19.3,20.8 20.5,19.6
N$52
  Top 0.4: U$4.P$20 23.2,22.2 21.7,23.7 21.4,24
  Top 0.6: C63.1 19.9,25.5 21.7,23.7
N$53
  Top 0.5: C64.2 R17.2
N$54
  Top 0.3: U5.3 41.28,47.54 R8.1
N$56
  Top 0.5: U1.8 73.6,10.06
  Top 0.8: 73.6,10.06 73.6,10.8 73.1,10.8 73.1,10.1 71.9,10.1 71.9,10.2
  Top 1.2: C66.1 71.9,10.5
  Top 2: D3.C 71.9,13.4
  Top 2.5: L1.1 71.9,17.1 71.9,13.4 71.9,10.5 71.9,10.2
N$57
  Top 0.3: U1.4 78,3.71 | 78,3.71 77.9,3.7 | 78,3.71 73,3.71 72.8,3.3 72.8,2.85 R2.1 72.65,2.7 72,2.7 71.7,2.4 71.7,1.5 71.25,1.05 R4.2
PA1_OUTNL
  Top 1: U$9.P$2 10.2,44.95 C36.2
  Bottom 2: U$1.1 9.6,44.4 U$9.P$2
PA1_OUTNR
  Top 1: C38.1 12.25,33.95 U$5.P$2
  Bottom 2: U$1.3 9.72,36.48 U$5.P$2
PA1_OUTPL
  Top 1: C37.2 12.2,38.2 U$8.P$2
  Bottom 2: U$8.P$2 3.84,40.4 U$1.2
PA1_OUTPR
  Top 1: C39.2 17.15,29.45 17,29.3 11,29.3 11,29.4 10.3,29.4 U$3.P$2
  Bottom 2: U$1.4 8.88,32.52 U$3.P$2
PA2_OUTNL
  Top 1: C56.2 12.1,23.5 U$11.P$2
  Bottom 2: U$11.P$2 9.7,25.6 8.5,24.4 U$12.1
PA2_OUTNR
  Top 1: C58.1 12.1,14 U$7.P$2
  Bottom 2: U$7.P$2 9.9,16.1 9.4,16.6 3.92,16.6 U$12.3
PA2_OUTPL
  Top 1: C57.2 12.2,18.6 U$10.P$2
  Bottom 2: U$10.P$2 8.6,20.8 8.3,20.5 3.86,20.5 U$12.2
PA2_OUTPR
  Top 1: C59.2 12.35,9.25 U$6.P$2
  Bottom 2: U$6.P$2 10.4,11.6 9.5,12.5 3.82,12.5 U$12.4
RMCK
  Bottom 0.5: JP2.17 36.33,4.87
SCL  (via drill 0.3)
  Top 0.3: 44.4,22.4 v44.2,22.2 43.6,22.2 v43.6,18.6 | v46.5,9.4 v44,11.9 | v48.8,9.4 54.8,9.4 v54.8,8.7
  Bottom 0.3: v43.6,18.6 43.6,12.5 v44,11.9 | v48.8,9.4 v46.5,9.4 | v54.8,8.7 54.8,6.9 55.4,6.1 55.4,3.7 54.1,2.4 JP2.4 | v44.2,22.2 45.2,22.4 IC1.2
SDA  (via drill 0.3)
  Top 0.3: v45.2,11.7 48.4,8.6 53.6,8.6 v53.7,8.7
  Bottom 0.3: v45.2,11.7 44.3,12.7 v44.3,21.2 45.4,21.1 IC1.1 | v53.7,8.7 53.5,8.5 53.5,6 52.8,6 52.8,3.6 51.6,3.6 51.6,2.4 JP2.6
V+  (via drill 0.3)
  Top 0.3: U5.5 44.34,44.95 v43.9,44.5 43.9,43.9 43.8,43.8 40.3,43.8 39.2,44.9 +3,3V.TP | v50.3,44.2 50.05,44.2 C20.1 | DAC1.8 49.15,34.75 v49,34.7 | DAC0.8 48.17,14.77 v48.1,14.7
  Bottom 0.3: v43.9,44.5 50,44.5 v50.3,44.2 50.2,44.1 50.2,42.2 52.5,39.9 52.5,36.9 51,35.4 51,34.7 | 51.1,19.1 51.1,15.9 50.2,15.9 50.2,14.7 v48.1,14.7 | 51.1,19.2 51.1,19.1 | 51.1,19.1 51,34.7 | v49,34.7 51,34.7

### Text on the board
tNames: + | + | + | + | MyAmpi - 2.0 / Vincent Delhalle / July 2016 | * | * | +
tDocu: +